# Altium schematic sheet Sheet1.SchDoc
size A4; SheetNumber: 1; SheetTotal: 1
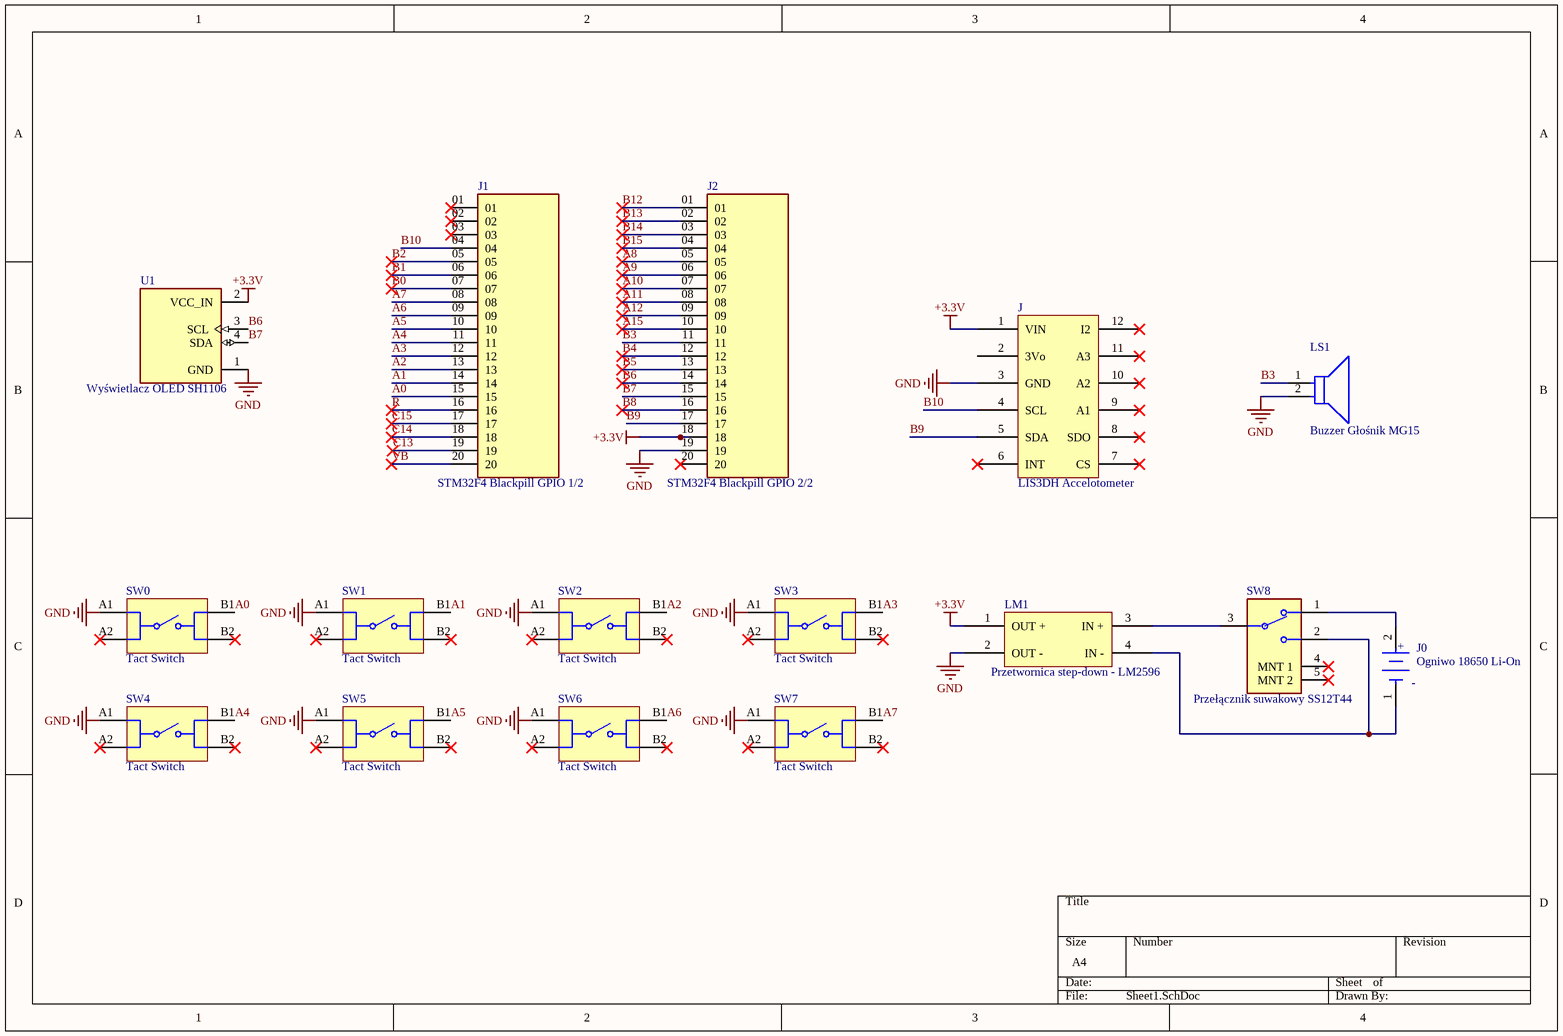
[diagram p0: Sheet1.SchDoc]

## Parts
J  LIS3DH Accelotometer  [PCBComponent_1]
J0  Ogniwo 18650 Li-On  [FP-1043P-MFG]
J1  STM32F4 Blackpill GPIO 1/2  [SAMTEC_TS-120-T-AA]
J2  STM32F4 Blackpill GPIO 2/2  [SAMTEC_TS-120-T-AA]
LM1  Przetwornica step-down - LM2596  [PCBComponent_1]
LS1  Buzzer Głośnik MG15  [FP-SDC1610MT-01-MFG]
SW0  Tact Switch  [430476043716]
SW1  Tact Switch  [430476043716]
SW2  Tact Switch  [430476043716]
SW3  Tact Switch  [430476043716]
SW4  Tact Switch  [430476043716]
SW5  Tact Switch  [430476043716]
SW6  Tact Switch  [430476043716]
SW7  Tact Switch  [430476043716]
SW8  Przełącznik suwakowy SS12T44  [FP-CSS-1210TB-MFG]
U1  Wyświetlacz OLED SH1106  [MODULE_DM-OLED096-636]

## Nets
+3.3V: J.1(VIN) J2.18 LM1.1(OUT_+) U1.2(VCC_IN)
GND: J.3(GND) J2.19 LM1.2(OUT_-) LS1.2(A) SW0.A1 SW1.A1 SW2.A1 SW3.A1 SW4.A1 SW5.A1 SW6.A1 SW7.A1 U1.1(GND)
A0: J1.15 SW0.B1
A1: J1.14 SW1.B1
A2: J1.13 SW2.B1
A3: J1.12 SW3.B1
A4: J1.11 SW4.B1
A5: J1.10 SW5.B1
A6: J1.09 SW6.B1
A7: J1.08 SW7.B1
A8: J2.05
A9: J2.06
A10: J2.07
A11: J2.08
A12: J2.09
A15: J2.10
B0: J1.07
B1: J1.06
B2: J1.05
B3: J2.11 LS1.1(C)
B4: J2.12
B5: J2.13
B6: J2.14 U1.3(SCL)
B7: J2.15 U1.4(SDA)
B8: J2.16
B9: J.5(SDA) J2.17
B10: J.4(SCL) J1.04
B12: J2.01
B13: J2.02
B14: J2.03
B15: J2.04
C13: J1.19
C14: J1.18
C15: J1.17
R: J1.16
VB: J1.20
NetJ0_1: J0.1(C) LM1.4(IN_-) SW8.2
NetJ0_2: J0.2(A) SW8.1
NetLM1_3: LM1.3(IN_+) SW8.3(C)

Not connected (* = marked no-connect by the designer): J 2(3Vo) 6(INT)* 7(CS)* 8(SDO)* 9(A1)* 10(A2)* 11(A3)* 12(I2)*; J1 01* 02* 03*; J2 20*; SW0 A2* B2*; SW1 A2* B2*; SW2 A2* B2*; SW3 A2* B2*; SW4 A2* B2*; SW5 A2* B2*; SW6 A2* B2*; SW7 A2* B2*; SW8 4(MNT_1)* 5(MNT_2)*

## Notes on the sheet
- (in symbol CMP-19636-000034-1) +

## Library data of the parts
J = LIS3DH
J0 = CMP-19636-000034-1: BATT HOLDER 18650 1 CELL PC PIN; Number of Cells: 1; Series: -; Termination: PC Pin; Package Quantity: 50; Min Operating Temperature: -50°C; Mount: Through Hole; Packaging: Tray; Max Operating Temperature: 145°C
J1 J2 = TS-120-T-AA: Headers & Wire Housings .100 Single Row Screw Machine Terminal Strip; MF: Samtec; Package: None; Price: None; Check_prices: https://www.snapeda.com/parts/TS-120-T-AA/Samtec/view-part/?ref=eda; Value: *; SnapEDA_Link: https://www.snapeda.com/parts/TS-120-T-AA/Samtec/view-part/?ref=snap; MP: TS-120-T-AA; Availability: In Stock; Purchase-URL: https://pricing.snapeda.com/search?q=TS-120-T-AA&ref=eda
LM1 = LM2596
LS1 = CMP-08413-000010-1: AUDIO MAGNETIC IND 8-16V TH; Max Supply Current: 25mA; Nominal Supply Voltage (DC): 12V; Input Type: DC; Frequency: 2.4kHz; Min Operating Temperature: -10°C; Packaging: Tray; Voltage Rating: 12V; Height: 10mm; Lead Free: Lead Free; Series: SDC; Operating Supply Current: 25mA; Diameter: 16mm; Max Operating Temperature: 70°C; Sensing Method: Magnetic; Mount: Through Hole; Termination: PC Pins
SW0-SW7 = CMP-1456-00007-3: Switch Tactile Spst-no 0.05A 12V; Contact Current Rating: 50mA; Mechanical Life: 500kcycles; Illumination Type: Illuminated, Non-Illuminated; Insulation Resistance: 100MΩ; Actuator Material: Liquid Crystal Polymer, Polymer; Throw Configuration: SPST; Switch Travel: 300µm; Actuator Length: 800µm; Switch Function: Off-Mom; Voltage Rating: 12V; Min Operating Temperature: -40°C; RoHS: Compliant; Termination: PC Pin; Current Rating: 50mA; Max Operating Temperature: 85°C; Packaging: Bulk; Height: 4.3mm; REACH SVHC: No SVHC; Contact Material: Silver, Stainless Steel; Mount: Through Hole; Contact Plating: Silver
SW8 = CMP-71745-000010-1: SWITCH SLIDE SPDT 100MA 12V; Actuator Material: Polymer; Switch Travel: 2mm; Number of Positions: 2; Contact Style: Non-Shorting; Operating Force: 357gf; Switch Function: On-On; Electrical Life: 10000Cycles; Number of Poles: 1; Actuator Type: Standard; Termination: Gull Wing; Contact Plating: Gold; Voltage Rating (DC): 12V; RoHS Compliant: Yes; Packaging: Tape and Reel; Max Operating Temperature: 70°C; Throw Configuration: SPDT; Case/Package: SMD/SMT; Contact Current Rating: 100mA; Actuator Length: 2mm; Mount: Surface Mount; Min Operating Temperature: -20°C; Max Voltage Rating (DC): 12V; Series: CSS; Orientation: Right Angle; Contact Material: Copper Alloy; Radiation Hardening: No; Current Rating: 100mA
U1 = DM-OLED096-636: 0.96â€ 128 X 64 MONOCHROME GRAPHIC OLED DISPLAY MODULE - I2C; SnapEDA_Link: https://www.snapeda.com/parts/DM-OLED096-636/Display+Module/view-part/?ref=snap; Package: Package; Value: *; MF: Display Module; MP: DM-OLED096-636; Check_prices: https://www.snapeda.com/parts/DM-OLED096-636/Display+Module/view-part/?ref=eda